# Altium schematic sheet STO.SchDoc
size 420 x 297 mm; DocumentNumber: 7; SheetNumber: 14; SheetTotal: 14; PageSetup: Record=PageOptions|CenterHorizontal=True|CenterVertical=True|PrintScale=0.96|XCorrection=1.00|YCorrection=1.00|PrintKind=1|BorderSize=5000000|LeftOffset=0|BottomOffset=0|Orientation=2|PaperLength=4318|PaperWidth=2794|Scale=100|PaperSource=7|PrintQuality=600|MediaType=1|DitherType=10|PaperKind=11" x 17"|PrintScaleMode=1
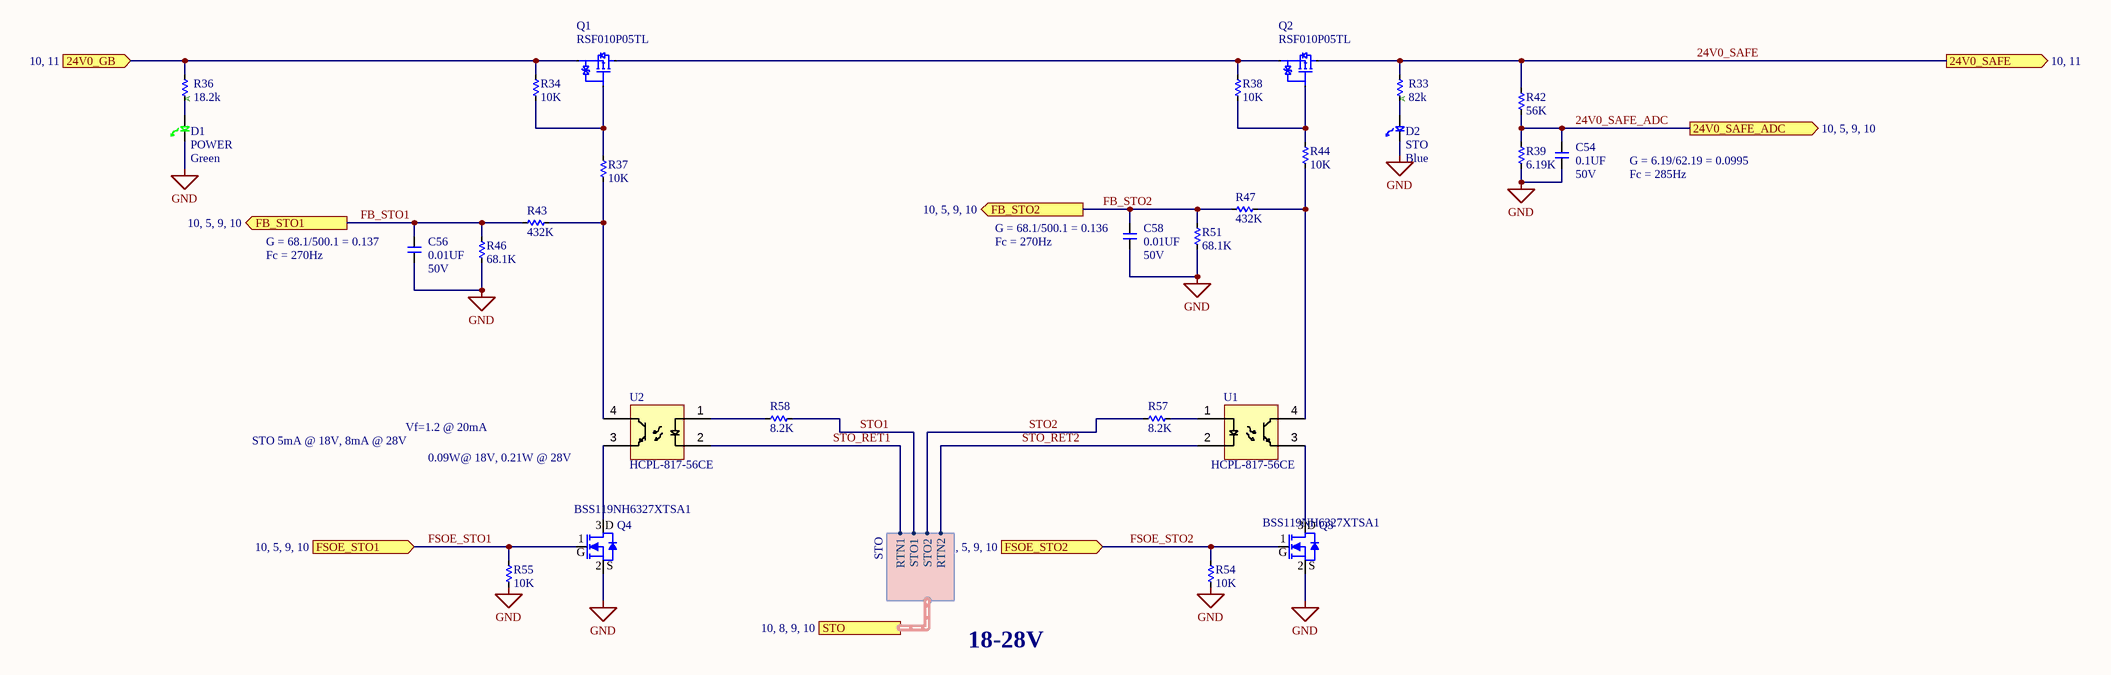
[diagram p0: STO.SchDoc]

## Parts
C54  value 0.1UF  Voltage: 50V  [C0402]  (hidden comment: __Template_Cap)
C56  value 0.01UF  Voltage: 50V  [C0402]  (hidden comment: __Template_Cap)
C58  value 0.01UF  Voltage: 50V  [C0402]  (hidden comment: __Template_Cap)
D1  POWER  value Green  [LEDSC160X80X90L40-GREEN]
D2  STO  value Blue  [LEDSC160X80X90L40-BLUE]
Q1  MFG P/N: RSF010P05TL  [TUMT3]  (hidden comment: PFET_RSF010P05TL)
Q2  MFG P/N: RSF010P05TL  [TUMT3]  (hidden comment: PFET_RSF010P05TL)
Q3  value BSS119NH6327XTSA1  [SOT23-3P95_240X110L43N]  (hidden comment: ONSEMI BSS123)
Q4  value BSS119NH6327XTSA1  [SOT23-3P95_240X110L43N]  (hidden comment: ONSEMI BSS123)
R33  value 82k  [R0402]  (hidden comment: PANASONIC ERJ2RKF8202X)
R34  10K  [R0402]
R36  value 18.2k  [R0402]  (hidden comment: PANASONIC ERJ2RKF1822X)
R37  10K  [R0402]
R38  10K  [R0402]
R39  6.19K  [R0402]
R42  56K  [R0402]
R43  432K  [R0402]
R44  10K  [R0402]
R46  68.1K  [R0402]
R47  432K  [R0402]
R51  68.1K  [R0402]
R54  10K  [R0402]
R55  10K  [R0402]
R57  8.2K  [R1206]
R58  8.2K  [R1206]
U1  MFG P/N: HCPL-817-56CE  [OPTO_HCPL-817-56CE]  (hidden comment: OPTO_HCPL-817-56CE)
U2  MFG P/N: HCPL-817-56CE  [OPTO_HCPL-817-56CE]  (hidden comment: OPTO_HCPL-817-56CE)

## Ports
24V0_GB (in, see 10, 11), 24V0_SAFE (out, see 10, 11), 24V0_SAFE_ADC (out, see 10, 5, 9, 10), FB_STO1 (out, see 10, 5, 9, 10), FB_STO2 (out, see 10, 5, 9, 10), FSOE_STO1 (in, see 10, 5, 9, 10), FSOE_STO2 (in, see 10, 5, 9, 10), STO (harness STO, see 10, 8, 9, 10)

## Harnesses
STO: RTN1, RTN2, STO1, STO2

## Nets
GND: C54.2 C56.2 C58.2 D1.1(CATHODE) D2.1(CATHODE) Q3.2(S) Q4.2(S) R39.1 R46.1 R51.1 R54.1 R55.1
24V0_GB: Q1.S R34.2 R36.2 ; port 24V0_GB
24V0_SAFE: Q2.D R33.2 R42.2 ; port 24V0_SAFE
24V0_SAFE_ADC: C54.1 R39.2 R42.1 ; port 24V0_SAFE_ADC
FB_STO1: C56.1 R43.1 R46.2 ; port FB_STO1
FB_STO2: C58.1 R47.1 R51.2 ; port FB_STO2
FSOE_STO1: Q4.1(G) R55.2 ; port FSOE_STO1
FSOE_STO2: Q3.1(G) R54.2 ; port FSOE_STO2
STO1: R58.2 ; port STO.STO1
STO2: R57.1 ; port STO.STO2
STO_RET1: U2.2(Cathode) ; port STO.RTN1
STO_RET2: U1.2(Cathode) ; port STO.RTN2
NetD1_2: D1.2(ANODE) R36.1
NetD2_2: D2.2(ANODE) R33.1
NetQ1_D: Q1.D Q2.S R38.2
NetQ1_G: Q1.G R34.1 R37.2
NetQ2_G: Q2.G R38.1 R44.2
NetQ3_3: Q3.3(D) U1.3(Emitter)
NetQ4_3: Q4.3(D) U2.3(Emitter)
NetR37_1: R37.1 R43.2 U2.4(Collector)
NetR44_1: R44.1 R47.2 U1.4(Collector)
NetR57_2: R57.2 U1.1(Anode)
NetR58_1: R58.1 U2.1(Anode)

## Notes on the sheet
- Fc = 285Hz
- G = 6.19/62.19 = 0.0995
- Fc = 270Hz
- (near C56) G = 68.1/500.1 = 0.137
- (near C58) G = 68.1/500.1 = 0.136
- STO 5mA @ 18V, 8mA @ 28V
- Vf=1.2 @ 20mA
- 0.09W@ 18V, 0.21W @ 28V
- 18-28V
- CREATIVE COMMONS
- PUBLIC LICENSE:
- BARKOUR ROBOT
- CC BY-NC 4.0
- APPROVED
- DWG NO
- GOOGLE LLC
- FILE
- RELEASED
- 2024/05/09
- SIZE
- 1600 AMPHITHEATRE PARKWAY
- MOUNTAIN VIEW CA 94043
- A3
- SHEET
- OF
- THIS DESIGN IS BEING PROVIDED  FOR NON-COMMERCIAL USE ONLY. THE USE OF =SCIENTIST_NAME_POSSESSIVE NAME IN CONNECTION WITH THE DESIGN IS NOT INTENDED TO IMPLY THAT =SCIENTIST_NAME SPONSORS OR ENDORSES THE DESIGN, GOOGLE LLC, OR ANY OF GOOGLE LLC'S PRODUCTS OR SERVICES.
- (in symbol 78eec7e5-34dd-5b0c-8bd5-fdbc658ba047) A
- (in symbol 07680e2d-088d-5a06-a7a1-fe9cd6488fb2) A

## Library data of the parts
C54 = 1762: CAP, CER, X5R, 0.1uF, 10%, 50V, 0402, 0.55mm; MFG: YAGEO; MFG P/N: CC0402KRX5R9BB104; Status: Released; Package: 0402; Supplier 1: Digi-Key; ComponentLink1URL: http://www.yageo.com/documents/recent/UPY-GPHC_X5R_4V-to-50V_25.pdf; Supplier Part Number 1: 311-3342-1-ND
C56 C58 = 625: CAP, CER, X7R, 0.01uF, 50V, 20%, 0402, 0.56mm T; MFG: KEMET; MFG P/N: C0402C103M5RACTU; COMMON: 150-00227-00; Status: Released; Package: 0402; Supplier 1: Digi-Key; ComponentLink1URL: https://www.digikey.com/en/products/detail/kemet/C0402C103M5RAC7867/2196227; Supplier Part Number 1: 399-C0402C103M5RAC7867CT-ND
D1 = 97055cde-46be-5a44-ad2e-f3c9fb2da68b: LED, GREEN, 569nm, 30mA, CLEAR, 0603; MFG: Lite-On Inc.; MFG P/N: LTST-C190GKT; Package: 0603 (1608 Metric); ComponentLink1URL: http://media.digikey.com/pdf/Data%20Sheets/Lite-On%20PDFs/LTST-C190GKT.pdf; Status: Released; Supplier 1: Digi-Key; Supplier Part Number 1: 160-1183-1-ND
D2 = f11939b8-268a-575b-b7c2-77af98891583: LED, BLUE, 470nm, 15mA, DIFFUSED, 0603; MFG: OSRAM Opto (ams OSRAM); MFG P/N: LB Q39E-N1OO-35-1; Package: 0603 (1608 Metric); ComponentLink1URL: https://www.digikey.com/en/products/detail/osram-opto-ams-osram/LB-Q39E-N1OO-35-1/2176321; Status: Released; Supplier 1: Digi-Key; Supplier Part Number 1: 475-2815-1-ND
Q1 Q2 = 171: MOSFET, PWR, P-CH, 45VDS, 1A ID, 460mOhm@ 1A, SMD-3; MFG: Rohm Semiconductor; Status: Released; Package: TUMT3; ComponentLink1URL: https://d1d2qsbl8m0m72.cloudfront.net/en/products/databook/datasheet/discrete/transistor/mosfet/rsf010p05tl-e.pdf; Supplier 1: Digi-Key; Supplier Part Number 1: RSF010P05TLCT-ND; Value: RSF010P05TL
Q3 Q4 = ed20cc43-0059-5b34-85f4-540c7b2cf9db: XSTR, MOSFET, ENHANCEMENT MODE, N-CH, 100V, 0.17A, SOT23-3; Package: SOT-23; ComponentLink1URL: https://www.digikey.com/en/products/detail/infineon-technologies/BSS119NH6327XTSA1/5409997; Status: Released; MFG: onsemi; MFG P/N: BSS119NH6327XTSA1; Supplier 1: Digi-Key; Supplier Part Number 1: BSS119NH6327XTSA1CT-ND
R33 = 07680e2d-088d-5a06-a7a1-fe9cd6488fb2: Res, 82k, +/-1%, 0.1W, 0402, AUTO GRADE; MFG: Panasonic Electronic Components; MFG P/N: ERJ-2RKF8202X; Package: 0402; ComponentLink1URL: http://industrial.panasonic.com/cdbs/www-data/pdf/RDA0000/AOA0000C304.pdf; Status: Preliminary; Supplier 1: Digi-Key; Supplier Part Number 1: P82.0KLCT-ND
R34 R37 R38 R44 R54 R55 = 7216: RES, 10K, 1%, 1/10W, 0402, AUTOGRADE; MFG: PANASONIC; MFG P/N: ERJ2RKF1002X; COMMON: 470-00319-00; Status: Released; Package: 0402; Value: 10K; Supplier 1: Digi-Key; ComponentLink1URL: https://www.digikey.com/en/products/detail/panasonic-electronic-components/ERJ-2RKF1002X/192073; Supplier Part Number 1: P10.0KLCT-ND
R36 = 78eec7e5-34dd-5b0c-8bd5-fdbc658ba047: Res, 18.2k, +/-1%, 0.1W, 0402, AUTO GRADE; MFG: Panasonic Electronic Components; MFG P/N: ERJ-2RKF1822X; Package: 0402; ComponentLink1URL: http://industrial.panasonic.com/cdbs/www-data/pdf/RDA0000/AOA0000C304.pdf; Status: Preliminary; Supplier 1: Digi-Key; Supplier Part Number 1: P18.2KLCT-ND
R39 = 9146: RES, 6.19K, 1%, 1/16W, 0402; MFG: Yageo; MFG P/N: RC0402FR-076K19L; Status: Released; Package: 0402; Value: 6.19K; Supplier 1: Digi-Key; ComponentLink1URL: http://www.yageo.com/documents/recent/PYu-RC_Group_51_RoHS_L_10.pdf; Supplier Part Number 1: 311-6.19KLRCT-ND
R42 = 8099: RES, 56K, 1%, 1/16W, 0402; MFG: VISHAY; MFG P/N: CRCW040256K0FKED; COMMON: 470-02723-00; Status: Released; Package: 0402; Value: 56K; Supplier 1: Digi-Key; ComponentLink1URL: https://www.digikey.com/en/products/detail/vishay-dale/CRCW040256K0FKED/1178206; Supplier Part Number 1: 541-56.0KLCT-ND
R43 R47 = 8801: RES, 432K, 1%, 1/16W, 0402; MFG: VISHAY; MFG P/N: CRCW0402432KFKED; Status: Released; Package: 0402; Value: 432K; Supplier 1: Digi-Key; ComponentLink1URL: http://www.vishay.com/docs/28773/crcwce3.pdf; Supplier Part Number 1: 541-432KLCT-ND
R46 R51 = 4849: RES, 68.1K, 1%, 1/16W, 0402; MFG: Stackpole Electronics Inc; MFG P/N: RMCF0402FT68K1; Status: Released; Package: 0402; Value: 68.1K; Supplier 1: Digi-Key; ComponentLink1URL: https://www.digikey.com/en/products/detail/stackpole-electronics-inc/RMCF0402FT68K1/1761637; Supplier Part Number 1: RMCF0402FT68K1CT-ND
R57 R58 = 3733: RES 8.2K OHM 1% 1/4W 1206; MFG: STACKPOLE ELECTRONICS; MFG P/N: RMCF1206FT8K20; Status: Released; Package: 1206; Value: 8.2K; Supplier 1: Digi-Key; ComponentLink1URL: https://www.digikey.com/en/products/detail/stackpole-electronics-inc/RMCF1206FT3K30/1753917; Supplier Part Number 1: RMCF1206FT8K20CT-ND
U1 U2 = 276: ISOLATOR, OPTOISOLATOR, PHOTO TRANSISTOR, 70V, 50mA, SMD-4; MFG: Broadcom Limited; Status: Released; Package: 4-SMD; Supplier 1: Digi-Key; ComponentLink1URL: https://docs.broadcom.com/doc/AV02-0265EN; Supplier Part Number 1: 516-3136-1-ND; Value: HCPL-817-56CE